# Altium schematic sheet EEU_SEH.SchDoc
size A4
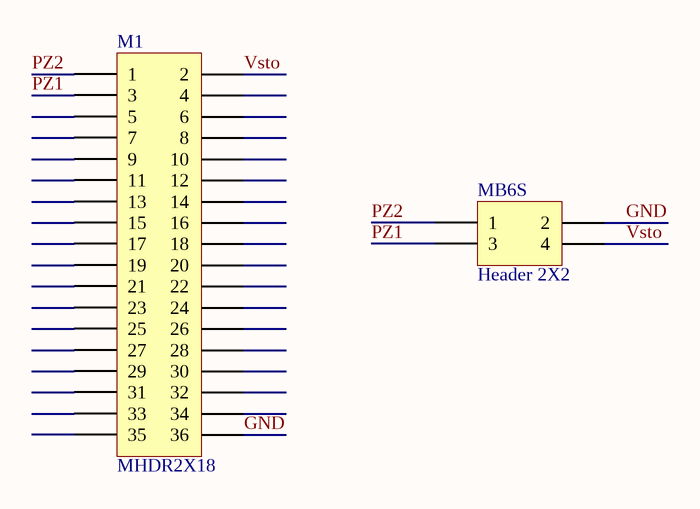
[diagram p0: EEU_SEH.SchDoc]

## Parts
M1  MHDR2X18  [module9x4]
MB6S  Header 2X2  [MB6S]

## Nets
GND: M1.36 MB6S.2
PZ1: M1.3 MB6S.3
PZ2: M1.1 MB6S.1
Vsto: M1.2 MB6S.4

Not connected (* = marked no-connect by the designer): M1 4 5 6 7 8 9 10 11 12 13 14 15 16 17 18 19 20 21 22 23 24 25 26 27 28 29 30 31 32 33 34 35

## Library data of the parts
M1 = MHDR2X18: Header, 18-Pin, Dual row; LatestRevisionDate: 17-Jul-2002; LatestRevisionNote: Re-released for DXP Platform.; Publisher: Altium Limited
MB6S = Header 2X2: Header, 2-Pin, Dual row; LatestRevisionDate: 17-Jul-2002; LatestRevisionNote: Re-released for DXP Platform.; Publisher: Altium Limited